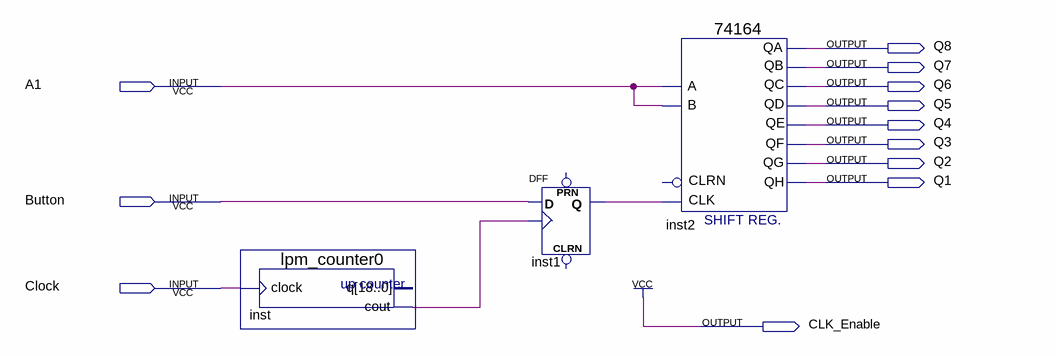
[diagram p0: schematic sheet]
// Quartus schematic lab5_2.bdf as structural Verilog: 3 symbols, 12 pins
module lab5_2 (
  input  A1,
  input  Button,
  input  Clock,
  output Q8,
  output Q7,
  output Q6,
  output Q5,
  output Q4,
  output Q3,
  output Q2,
  output Q1,
  output CLK_Enable
);

  wire inst1_q, inst_cout;

  lpm_counter0 inst (.clock(Clock), .cout(inst_cout));  // open: q
  DFF inst1 (.CLK(inst_cout), .D(Button), .Q(inst1_q));  // open: CLRN, PRN
  \74164  inst2 (
    .CLK(inst1_q), .B(A1), .A(A1), .QD(Q5), .QC(Q6), .QA(Q8), .QF(Q3), .QH(Q1), .QG(Q2), .QE(Q4), .QB(Q7));  // open: CLRN

  assign CLK_Enable = 1'b1;
endmodule
